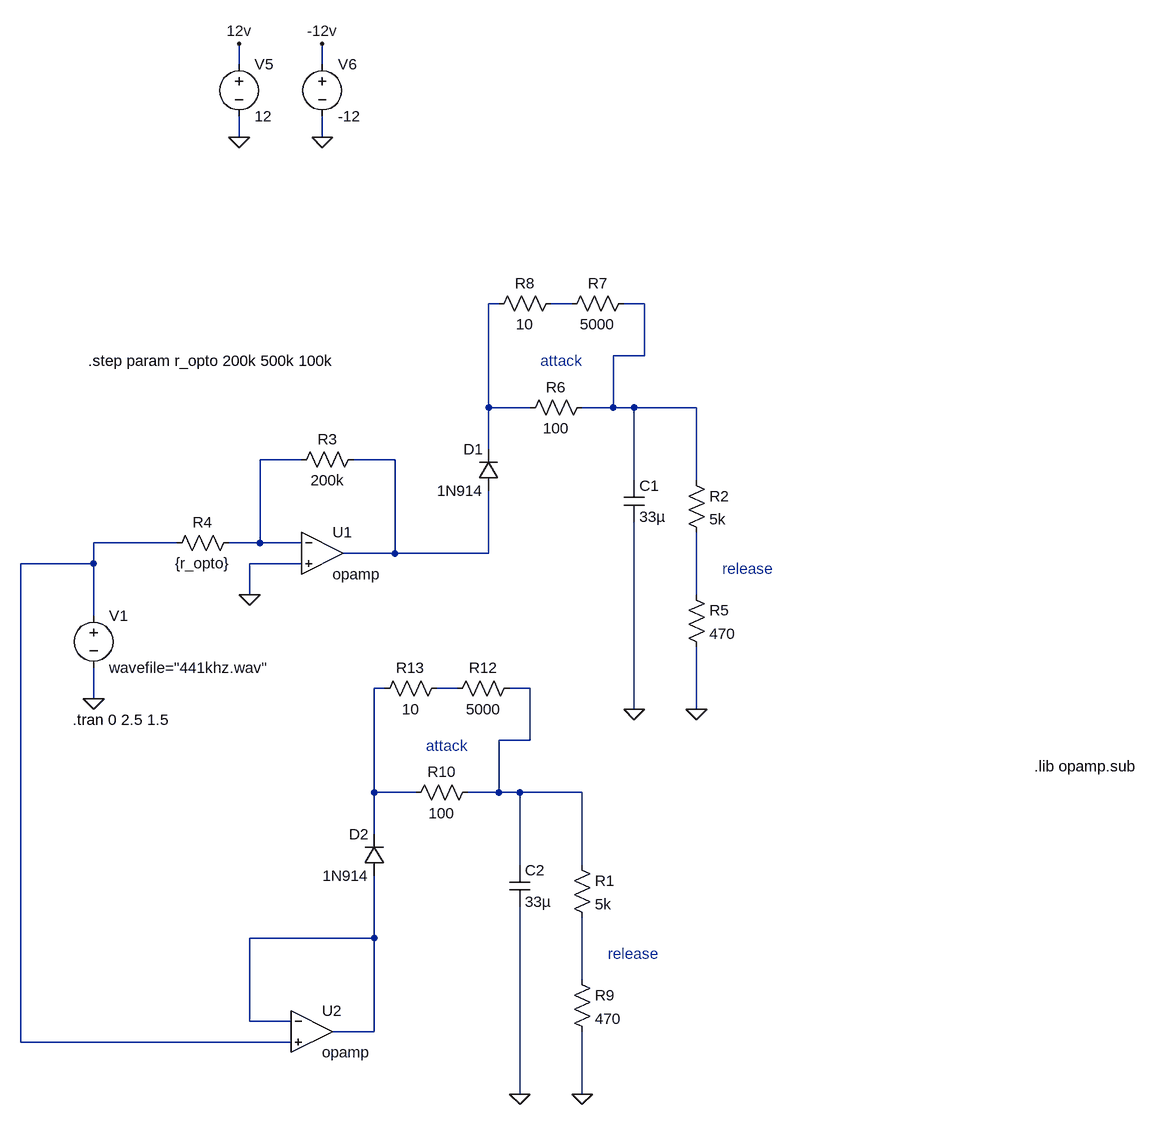
[diagram p0: schematic Opto-reciever.asc]
Opto-reciever.asc, the LTspice schematic file:
Version 4
SHEET 1 4852 1284
WIRE 944 -464 944 -496
WIRE 1072 -464 1072 -496
WIRE 944 -352 944 -384
WIRE 1072 -352 1072 -384
WIRE 1344 -96 1328 -96
WIRE 1456 -96 1424 -96
WIRE 1568 -96 1536 -96
WIRE 1568 -16 1568 -96
WIRE 1568 -16 1520 -16
WIRE 1328 64 1328 -96
WIRE 1392 64 1328 64
WIRE 1520 64 1520 -16
WIRE 1520 64 1472 64
WIRE 1552 64 1520 64
WIRE 1648 64 1552 64
WIRE 1328 128 1328 64
WIRE 1040 144 976 144
WIRE 1184 144 1120 144
WIRE 1552 176 1552 64
WIRE 1648 176 1648 64
WIRE 848 272 720 272
WIRE 976 272 976 144
WIRE 976 272 928 272
WIRE 1040 272 976 272
WIRE 1184 288 1184 144
WIRE 1184 288 1104 288
WIRE 1328 288 1328 192
WIRE 1328 288 1184 288
WIRE 720 304 720 272
WIRE 720 304 608 304
WIRE 1040 304 960 304
WIRE 960 352 960 304
WIRE 1648 352 1648 256
WIRE 720 384 720 304
WIRE 1168 496 1152 496
WIRE 1280 496 1248 496
WIRE 1392 496 1360 496
WIRE 720 512 720 464
WIRE 1552 528 1552 240
WIRE 1648 528 1648 432
WIRE 1392 576 1392 496
WIRE 1392 576 1344 576
WIRE 1152 656 1152 496
WIRE 1216 656 1152 656
WIRE 1344 656 1344 576
WIRE 1344 656 1296 656
WIRE 1376 656 1344 656
WIRE 1472 656 1376 656
WIRE 1152 720 1152 656
WIRE 1376 768 1376 656
WIRE 1472 768 1472 656
WIRE 1152 880 1152 784
WIRE 1152 880 960 880
WIRE 1472 944 1472 848
WIRE 960 1008 960 880
WIRE 1024 1008 960 1008
WIRE 1152 1024 1152 880
WIRE 1152 1024 1088 1024
WIRE 608 1040 608 304
WIRE 1024 1040 608 1040
WIRE 1376 1120 1376 832
WIRE 1472 1120 1472 1024
FLAG 720 512 0
FLAG 960 352 0
FLAG 944 -352 0
FLAG 1072 -352 0
FLAG 1072 -496 -12v
FLAG 944 -496 12v
FLAG 1648 528 0
FLAG 1552 528 0
FLAG 1472 1120 0
FLAG 1376 1120 0
SYMBOL voltage 720 368 R0
SYMATTR InstName V1
SYMATTR Value wavefile="441khz.wav"
SYMBOL Opamps\\opamp 1072 224 R0
SYMATTR InstName U1
SYMBOL res 944 256 R90
WINDOW 0 0 56 VBottom 2
WINDOW 3 32 56 VTop 2
SYMATTR InstName R4
SYMATTR Value {r_opto}
SYMBOL res 1136 128 R90
WINDOW 0 0 56 VBottom 2
WINDOW 3 32 56 VTop 2
SYMATTR InstName R3
SYMATTR Value 200k
SYMBOL voltage 1072 -480 R0
WINDOW 123 0 0 Left 2
WINDOW 39 0 0 Left 2
SYMATTR InstName V6
SYMATTR Value -12
SYMBOL voltage 944 -480 R0
WINDOW 123 0 0 Left 2
WINDOW 39 0 0 Left 2
SYMATTR InstName V5
SYMATTR Value 12
SYMBOL diode 1344 192 R180
WINDOW 0 24 64 Left 2
WINDOW 3 24 0 Left 2
SYMATTR InstName D1
SYMATTR Value 1N914
SYMBOL cap 1536 176 R0
SYMATTR InstName C1
SYMATTR Value 33µ
SYMBOL res 1632 160 R0
SYMATTR InstName R2
SYMATTR Value 5k
SYMBOL res 1632 336 R0
SYMATTR InstName R5
SYMATTR Value 470
SYMBOL res 1376 80 R270
WINDOW 0 32 56 VTop 2
WINDOW 3 0 56 VBottom 2
SYMATTR InstName R6
SYMATTR Value 100
SYMBOL res 1552 -112 R90
WINDOW 0 0 56 VBottom 2
WINDOW 3 32 56 VTop 2
SYMATTR InstName R7
SYMATTR Value 5000
SYMBOL res 1440 -112 R90
WINDOW 0 0 56 VBottom 2
WINDOW 3 32 56 VTop 2
SYMATTR InstName R8
SYMATTR Value 10
SYMBOL Opamps\\opamp 1056 960 R0
SYMATTR InstName U2
SYMBOL diode 1168 784 R180
WINDOW 0 24 64 Left 2
WINDOW 3 24 0 Left 2
SYMATTR InstName D2
SYMATTR Value 1N914
SYMBOL cap 1360 768 R0
SYMATTR InstName C2
SYMATTR Value 33µ
SYMBOL res 1456 752 R0
SYMATTR InstName R1
SYMATTR Value 5k
SYMBOL res 1456 928 R0
SYMATTR InstName R9
SYMATTR Value 470
SYMBOL res 1200 672 R270
WINDOW 0 32 56 VTop 2
WINDOW 3 0 56 VBottom 2
SYMATTR InstName R10
SYMATTR Value 100
SYMBOL res 1376 480 R90
WINDOW 0 0 56 VBottom 2
WINDOW 3 32 56 VTop 2
SYMATTR InstName R12
SYMATTR Value 5000
SYMBOL res 1264 480 R90
WINDOW 0 0 56 VBottom 2
WINDOW 3 32 56 VTop 2
SYMATTR InstName R13
SYMATTR Value 10
TEXT 688 544 Left 2 !.tran 0 2.5 1.5
TEXT 2168 616 Left 2 !.lib opamp.sub
TEXT 712 -8 Left 2 !.step param r_opto 200k 500k 100k
TEXT 1688 312 Left 2 ;release
TEXT 1408 -8 Left 2 ;attack
TEXT 1512 904 Left 2 ;release
TEXT 1232 584 Left 2 ;attack

The netlist it stands for:
* Opto-reciever.asc
V1 N006 0 wavefile="441khz.wav"
XU1 N004 0 N005 opamp Aol=100K GBW=10Meg  ; pins invin noninvin out
R4 N004 N006 {r_opto}
R3 N005 N004 200k
V6 -12v 0 -12
V5 12v 0 12
D1 N005 N001 1N914
C1 N003 0 33µ
R2 N003 N007 5k
R5 N007 0 470
R6 N001 N003 100
R7 N003 N002 5000
R8 N002 N001 10
XU2 N011 N006 N011 opamp Aol=100K GBW=10Meg  ; pins invin noninvin out
D2 N011 N008 1N914
C2 N010 0 33µ
R1 N010 N012 5k
R9 N012 0 470
R10 N008 N010 100
R12 N010 N009 5000
R13 N009 N008 10
.model D D
.lib standard.dio
.tran 0 2.5 1.5
.lib opamp.sub
.step param r_opto 200k 500k 100k
* release
* attack
* release
* attack
.backanno
.end